# EAGLE design switch (EAGLE 8.0.1)
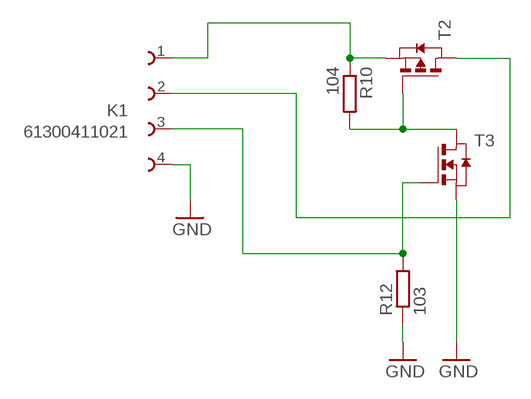
[diagram p0: schematic, sheet 1]

## Parts
K1  61300411021  [61300411021]
R10  104  R-EU_R0603  [R0603]
R12  103  R-EU_R0603  [R0603]
T2  PMOSSOT23  [SOT-23]
T3  NMOSSOT23  [SOT-23]

## Nets
GND: K1.4 R12.1 T3.2(S)
N$1: K1.2 T2.1(D)
N$2: R10.2 T2.3(G) T3.1(D)
N$3: K1.3 R12.2 T3.3(G)
N$4: K1.1 R10.1 T2.2(S)

## Library data of the parts
K1 = Board_to_Board_Connectors_rev15d:61300411021: WR-PHD 2.54mm Angled Pin Header, 4 Pins =>Con_BTB_PHD_2.54_1_THT_61300411021 <http://katalog.we-online.de/media/images/eican/Con_BTB_PHD_2.54_1_THT_61303211021_pf2.jpg> Details see: http://katalog.we-online.de/en/em/613_0xx_110_21 Created 2014-05-29, Karrer Zheng 2014 (C) Würth Elektronik
R10 R12 = resistor:R-EU_: RESISTOR, European symbol
T2 = zetex:PMOSSOT23: MOS FET; OC_FARNELL: unknown; OC_NEWARK: unknown
T3 = zetex:NMOSSOT23: MOS FET; OC_FARNELL: unknown; OC_NEWARK: unknown

## Board
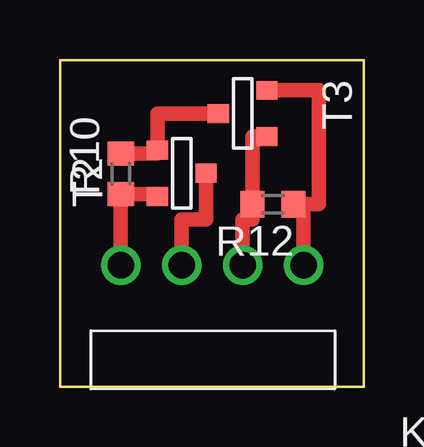
[diagram p1: board, top side]

Size 12.68 x 13.64 mm. Coordinates in mm from the lower left corner, seen from the top.
Outline: 0,0 12.68,0 12.68,13.64 0,13.64 0,0
Copper layers (1*16): Top 0.035mm / dielectric 1.5mm / Bottom 0.035mm
Design rules "default": minimum track width 10mil, minimum drill 24mil, track to track 8mil, track to pad 8mil, pad to pad 8mil, via to via 8mil, smd to smd 8mil, copper to edge 40mil, drill to drill 8mil, minimum pad ring 10mil, minimum via ring 8mil, stop-mask expansion 4mil, vias tented up to drill 0mil, thermal gap 10mil

### Footprints (pad centres in the part's own frame; a part is rotated, then mirrored left to right if it is on the bottom)
61300411021 = drill 1.1: 1 3.81,0; 2 1.27,0; 3 -1.27,0; 4 -3.81,0
R0603 = smd 1 x 1.1: 1 -0.85,0; 2 0.85,0
SOT-23 = smd 0.787 x 0.889: 1 0.025,-1.016; 2 -0.94,1.016; 3 0.991,1.016

### Placement (x,y rotation side)
K1  6.35,5.08 180 top
R10  2.54,8.89 90 top
R12  8.89,7.62 180 top
T2  5.08,8.89 90 top
T3  7.62,11.43 270 top

### Tracks (layer width: path | path; a pad name or v marks a point on that pad's centre or on a via)
GND
  Top 0.61: T3.2 10.8,12.37 10.8,7.62 10.16,7.62 | 10.16,7.62 R12.1 | K1.4 10.16,7.62
N$1
  Top 0.61: T2.1 6.1,6.99 5.08,6.99 K1.2
N$2
  Top 0.61: R10.2 4.06,9.74 T2.3 4.06,11.4 T3.1
N$3
  Top 0.61: T3.3 8.04,10.44 R12.2 8.04,6.99 7.62,6.99 K1.3
N$4
  Top 0.61: T2.2 4.06,8.04 R10.1 K1.1